# Altium schematic sheet FPGA_MGT.SchDoc: SVPXFMC Carrier 3U
size 420 x 297 mm; CheckedBy: \; Author: G.Kasprowicz; CompanyName: ISE; DrawnBy: T.Przywozki; Organization: WUT ISE; Address1: Warsaw University of Technology; Address2: Nowowiejska 15/19 00-665 Warsaw; Revision: 1.0.; SheetNumber: 9; SheetTotal: 20; Project: SVPXFMC Carrier 3U; ModifiedBy: -; CheckedDate: -; Title2: FPGA MGT; DivGrp: ISE; Designer: G. Kasprowicz
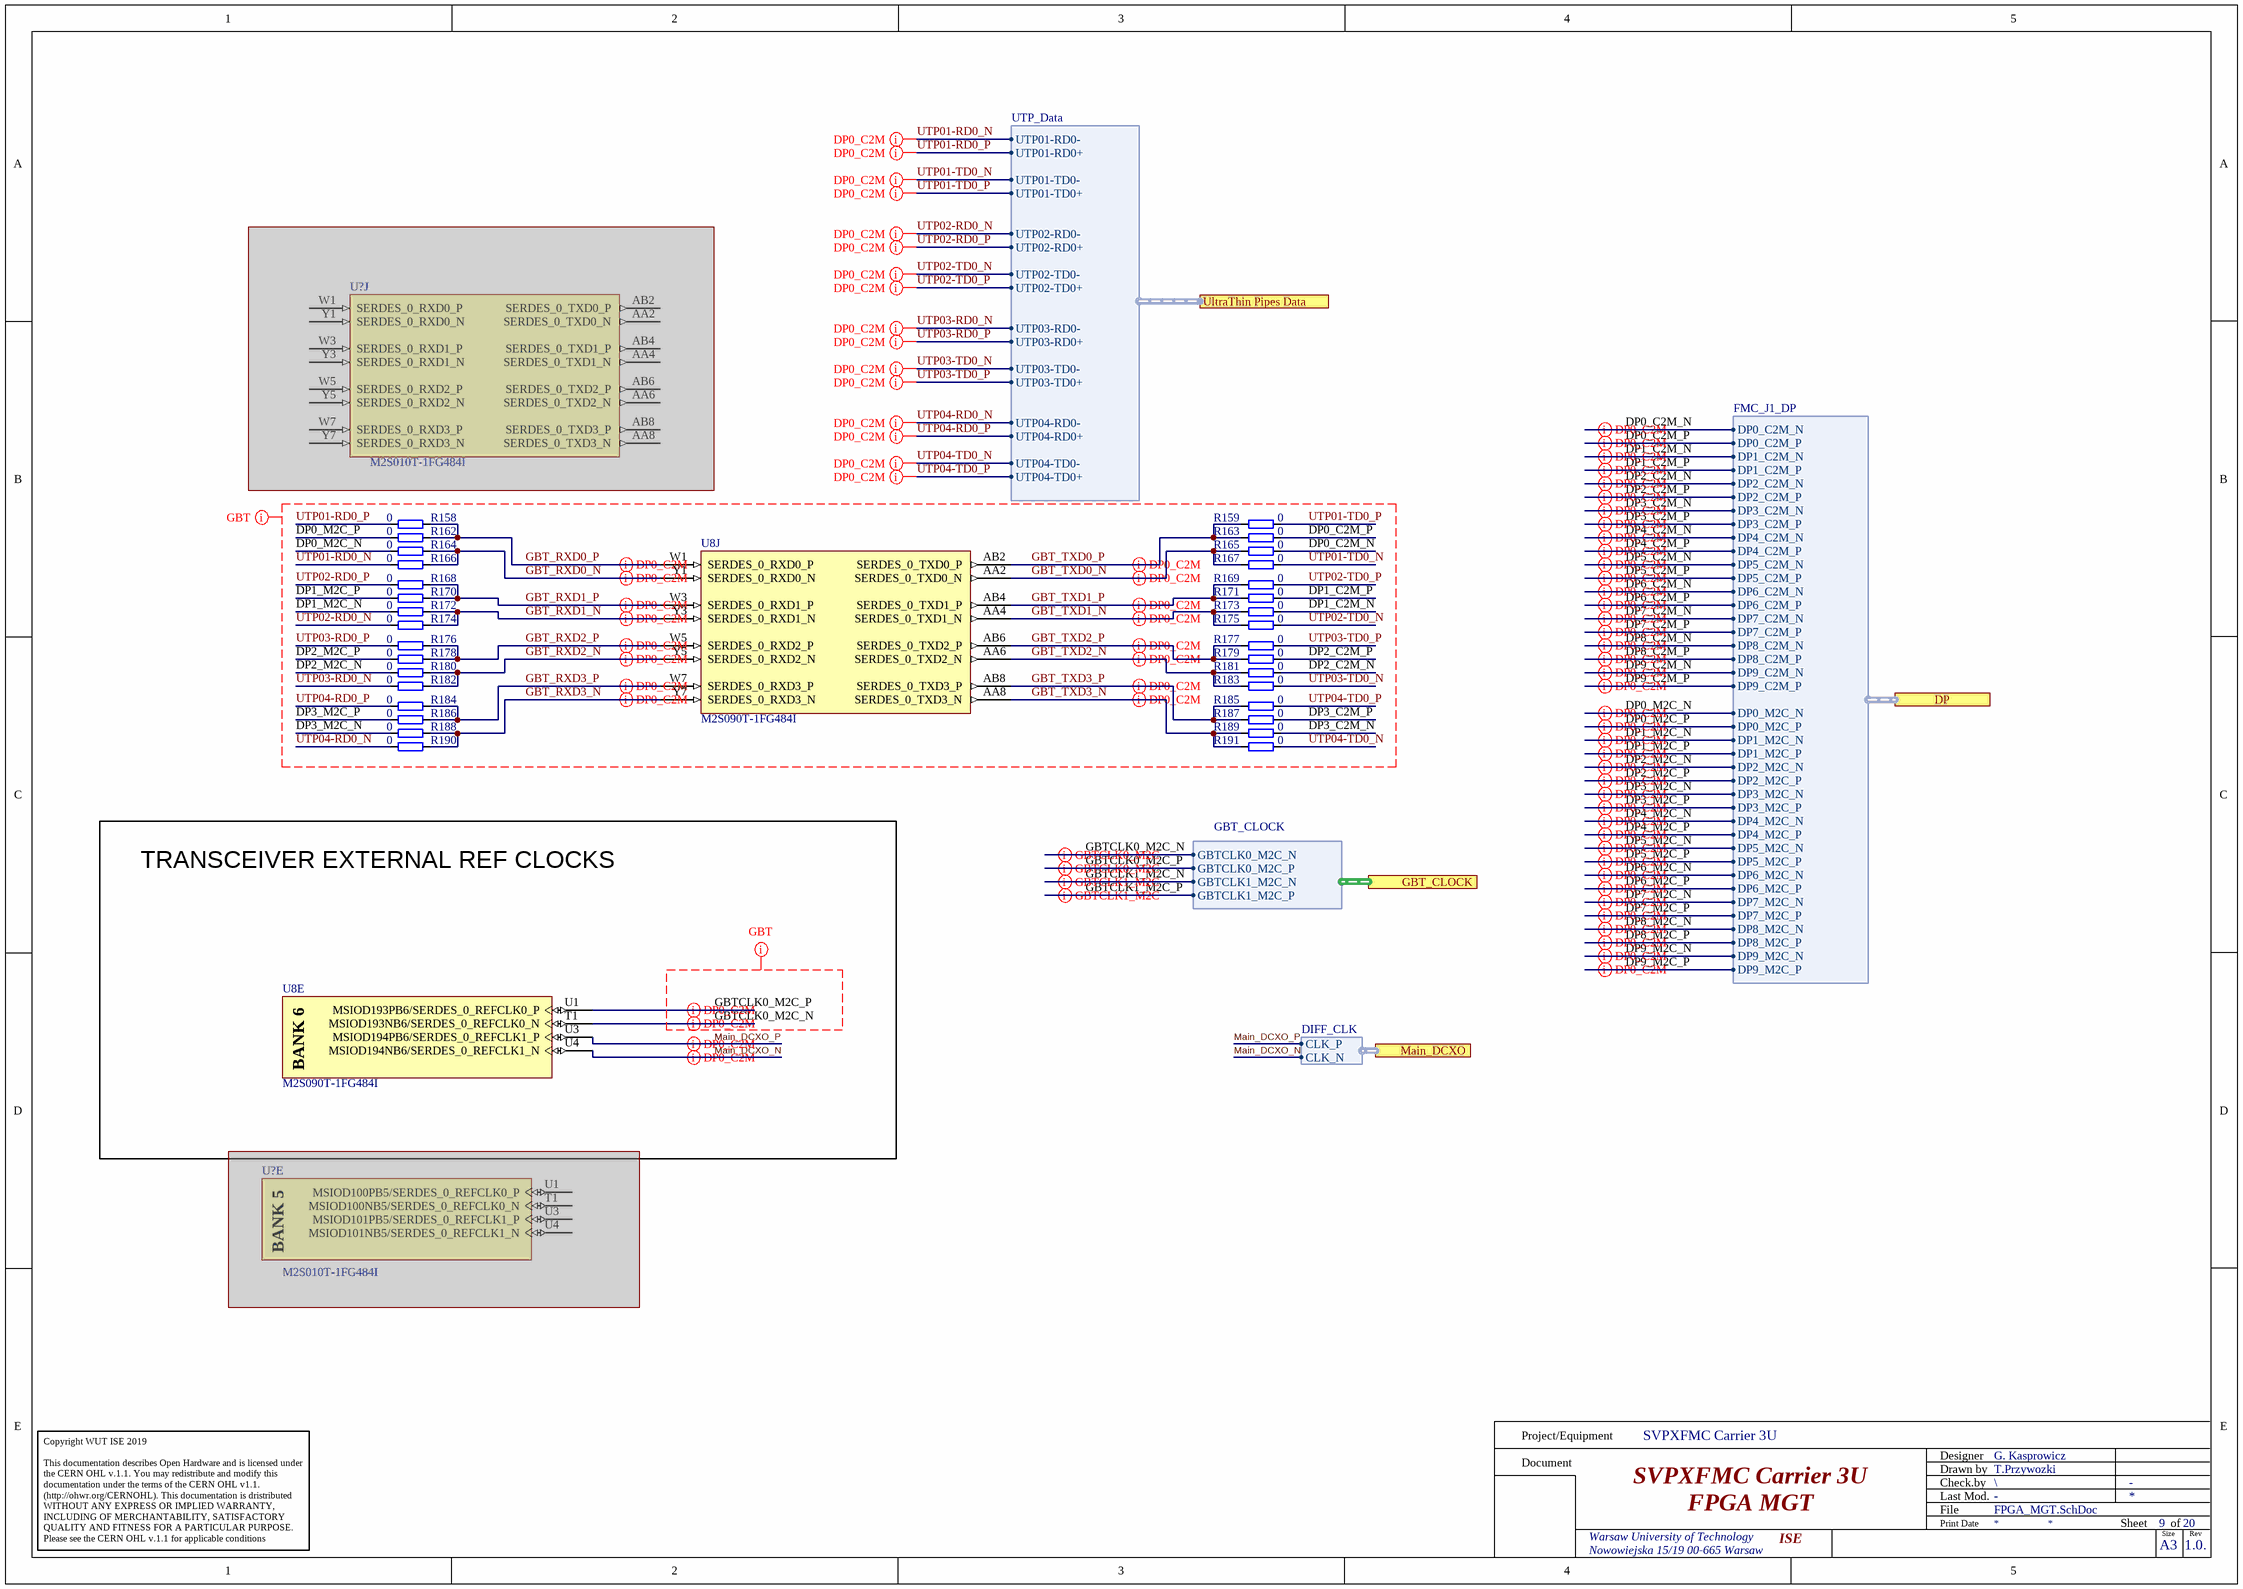
[diagram p0: FPGA_MGT.SchDoc]

## Parts
(Parts that share a designator on the sheet are numbered #1, #2 ... from top to bottom, then left to right.)
R158  0  [RESC0603X28N]
R159  0  [RESC0603X28N]
R162  0  [RESC0603X28N]
R163  0  [RESC0603X28N]
R164  0  [RESC0603X28N]
R165  0  [RESC0603X28N]
R166  0  [RESC0603X28N]
R167  0  [RESC0603X28N]
R168  0  [RESC0603X28N]
R169  0  [RESC0603X28N]
R170  0  [RESC0603X28N]
R171  0  [RESC0603X28N]
R172  0  [RESC0603X28N]
R173  0  [RESC0603X28N]
R174  0  [RESC0603X28N]
R175  0  [RESC0603X28N]
R176  0  [RESC0603X28N]
R177  0  [RESC0603X28N]
R178  0  [RESC0603X28N]
R179  0  [RESC0603X28N]
R180  0  [RESC0603X28N]
R181  0  [RESC0603X28N]
R182  0  [RESC0603X28N]
R183  0  [RESC0603X28N]
R184  0  [RESC0603X28N]
R185  0  [RESC0603X28N]
R186  0  [RESC0603X28N]
R187  0  [RESC0603X28N]
R188  0  [RESC0603X28N]
R189  0  [RESC0603X28N]
R190  0  [RESC0603X28N]
R191  0  [RESC0603X28N]
U8  M2S090T-1FG484I  [MCSM-FG-484_V]  (parts E,J of 15)
U?#1  M2S010T-1FG484I  [MCSM-FG-484_V]  (part J of 16)  (masked out: inside a compile mask, not in the netlist)
U?#2  M2S010T-1FG484I  [MCSM-FG-484_V]  (part E of 16)  (masked out: inside a compile mask, not in the netlist)

## Blocks framed on the sheet
TRANSCEIVER EXTERNAL REF CLOCKS: U8

## Ports
DP (harness FMC_J1_DP), GBT_CLOCK (harness GBT_CLOCK), Main_DCXO (harness DIFF_CLK), UltraThin Pipes Data (harness UTP_Data)

## Harnesses
FMC_J1_DP: DP1_C2M_N, DP1_C2M_P, DP1_M2C_N, DP1_M2C_P, DP2_C2M_N, DP2_C2M_P, DP2_M2C_N, DP2_M2C_P, DP3_C2M_N, DP3_C2M_P, DP3_M2C_N, DP3_M2C_P, DP0_C2M_N, DP0_C2M_P, DP0_M2C_N, DP0_M2C_P, DP4_C2M_N, DP4_C2M_P, DP5_C2M_N, DP5_C2M_P, DP6_C2M_N, DP6_C2M_P, DP7_C2M_N, DP7_C2M_P, DP8_C2M_N, DP8_C2M_P, DP9_C2M_N, DP9_C2M_P, DP4_M2C_N, DP4_M2C_P, DP5_M2C_N, DP5_M2C_P, DP6_M2C_N, DP6_M2C_P, DP7_M2C_N, DP7_M2C_P, DP8_M2C_N, DP8_M2C_P, DP9_M2C_N, DP9_M2C_P
GBT_CLOCK: GBTCLK0_M2C_N, GBTCLK0_M2C_P, GBTCLK1_M2C_N, GBTCLK1_M2C_P
DIFF_CLK: CLK_N, CLK_P
UTP_Data: UTP01-RD0-, UTP01-RD0+, UTP01-TD0-, UTP01-TD0+, UTP02-RD0-, UTP02-RD0+, UTP02-TD0-, UTP02-TD0+, UTP03-RD0-, UTP03-RD0+, UTP03-TD0-, UTP03-TD0+, UTP04-RD0-, UTP04-RD0+, UTP04-TD0-, UTP04-TD0+

## Nets
DP0_C2M_N: R165.2 ; port DP.DP0_C2M_N
DP0_C2M_P: R163.2 ; port DP.DP0_C2M_P
DP0_M2C_N: R164.2 ; port DP.DP0_M2C_N
DP0_M2C_P: R162.2 ; port DP.DP0_M2C_P
DP1_C2M_N: R173.2 ; port DP.DP1_C2M_N
DP1_C2M_P: R171.2 ; port DP.DP1_C2M_P
DP1_M2C_N: R172.2 ; port DP.DP1_M2C_N
DP1_M2C_P: R170.2 ; port DP.DP1_M2C_P
DP2_C2M_N: R181.2 ; port DP.DP2_C2M_N
DP2_C2M_P: R179.2 ; port DP.DP2_C2M_P
DP2_M2C_N: R180.2 ; port DP.DP2_M2C_N
DP2_M2C_P: R178.2 ; port DP.DP2_M2C_P
DP3_C2M_N: R189.2 ; port DP.DP3_C2M_N
DP3_C2M_P: R187.2 ; port DP.DP3_C2M_P
DP3_M2C_N: R188.2 ; port DP.DP3_M2C_N
DP3_M2C_P: R186.2 ; port DP.DP3_M2C_P
DP4_C2M_N: port DP.DP4_C2M_N
DP4_C2M_P: port DP.DP4_C2M_P
DP4_M2C_N: port DP.DP4_M2C_N
DP4_M2C_P: port DP.DP4_M2C_P
DP5_C2M_N: port DP.DP5_C2M_N
DP5_C2M_P: port DP.DP5_C2M_P
DP5_M2C_N: port DP.DP5_M2C_N
DP5_M2C_P: port DP.DP5_M2C_P
DP6_C2M_N: port DP.DP6_C2M_N
DP6_C2M_P: port DP.DP6_C2M_P
DP6_M2C_N: port DP.DP6_M2C_N
DP6_M2C_P: port DP.DP6_M2C_P
DP7_C2M_N: port DP.DP7_C2M_N
DP7_C2M_P: port DP.DP7_C2M_P
DP7_M2C_N: port DP.DP7_M2C_N
DP7_M2C_P: port DP.DP7_M2C_P
DP8_C2M_N: port DP.DP8_C2M_N
DP8_C2M_P: port DP.DP8_C2M_P
DP8_M2C_N: port DP.DP8_M2C_N
DP8_M2C_P: port DP.DP8_M2C_P
DP9_C2M_N: port DP.DP9_C2M_N
DP9_C2M_P: port DP.DP9_C2M_P
DP9_M2C_N: port DP.DP9_M2C_N
DP9_M2C_P: port DP.DP9_M2C_P
GBT_RXD0_N: R164.1 R166.1 U8.Y1(SERDES_0_RXD0_N)
GBT_RXD0_P: R158.1 R162.1 U8.W1(SERDES_0_RXD0_P)
GBT_RXD1_N: R172.1 R174.1 U8.Y3(SERDES_0_RXD1_N)
GBT_RXD1_P: R168.1 R170.1 U8.W3(SERDES_0_RXD1_P)
GBT_RXD2_N: R180.1 R182.1 U8.Y5(SERDES_0_RXD2_N)
GBT_RXD2_P: R176.1 R178.1 U8.W5(SERDES_0_RXD2_P)
GBT_RXD3_N: R188.1 R190.1 U8.Y7(SERDES_0_RXD3_N)
GBT_RXD3_P: R184.1 R186.1 U8.W7(SERDES_0_RXD3_P)
GBT_TXD0_N: R165.1 R167.1 U8.AA2(SERDES_0_TXD0_N)
GBT_TXD0_P: R159.1 R163.1 U8.AB2(SERDES_0_TXD0_P)
GBT_TXD1_N: R173.1 R175.1 U8.AA4(SERDES_0_TXD1_N)
GBT_TXD1_P: R169.1 R171.1 U8.AB4(SERDES_0_TXD1_P)
GBT_TXD2_N: R181.1 R183.1 U8.AA6(SERDES_0_TXD2_N)
GBT_TXD2_P: R177.1 R179.1 U8.AB6(SERDES_0_TXD2_P)
GBT_TXD3_N: R189.1 R191.1 U8.AA8(SERDES_0_TXD3_N)
GBT_TXD3_P: R185.1 R187.1 U8.AB8(SERDES_0_TXD3_P)
GBTCLK0_M2C_N: U8.T1(MSIOD193NB6/SERDES_0_REFCLK0_N) ; port GBT_CLOCK.GBTCLK0_M2C_N
GBTCLK0_M2C_P: U8.U1(MSIOD193PB6/SERDES_0_REFCLK0_P) ; port GBT_CLOCK.GBTCLK0_M2C_P
GBTCLK1_M2C_N: port GBT_CLOCK.GBTCLK1_M2C_N
GBTCLK1_M2C_P: port GBT_CLOCK.GBTCLK1_M2C_P
Main_DCXO_N: U8.U4(MSIOD194NB6/SERDES_0_REFCLK1_N) ; port Main_DCXO.CLK_N
Main_DCXO_P: U8.U3(MSIOD194PB6/SERDES_0_REFCLK1_P) ; port Main_DCXO.CLK_P
UTP01-RD0_N: R166.2 ; port UltraThin Pipes Data.UTP01-RD0-
UTP01-RD0_P: R158.2 ; port UltraThin Pipes Data.UTP01-RD0+
UTP01-TD0_N: R167.2 ; port UltraThin Pipes Data.UTP01-TD0-
UTP01-TD0_P: R159.2 ; port UltraThin Pipes Data.UTP01-TD0+
UTP02-RD0_N: R174.2 ; port UltraThin Pipes Data.UTP02-RD0-
UTP02-RD0_P: R168.2 ; port UltraThin Pipes Data.UTP02-RD0+
UTP02-TD0_N: R175.2 ; port UltraThin Pipes Data.UTP02-TD0-
UTP02-TD0_P: R169.2 ; port UltraThin Pipes Data.UTP02-TD0+
UTP03-RD0_N: R182.2 ; port UltraThin Pipes Data.UTP03-RD0-
UTP03-RD0_P: R176.2 ; port UltraThin Pipes Data.UTP03-RD0+
UTP03-TD0_N: R183.2 ; port UltraThin Pipes Data.UTP03-TD0-
UTP03-TD0_P: R177.2 ; port UltraThin Pipes Data.UTP03-TD0+
UTP04-RD0_N: R190.2 ; port UltraThin Pipes Data.UTP04-RD0-
UTP04-RD0_P: R184.2 ; port UltraThin Pipes Data.UTP04-RD0+
UTP04-TD0_N: R191.2 ; port UltraThin Pipes Data.UTP04-TD0-
UTP04-TD0_P: R185.2 ; port UltraThin Pipes Data.UTP04-TD0+

## Layout directives
differential pair: GBTCLK0_M2C_N, GBTCLK0_M2C_P, GBTCLK1_M2C_N, GBTCLK1_M2C_P, Main_DCXO_N, Main_DCXO_P
differential pair; differential pair class GBT: DP0_C2M_N, DP0_C2M_P, DP0_M2C_N, DP0_M2C_P, DP1_C2M_N, DP1_C2M_P, DP1_M2C_N, DP1_M2C_P, DP2_C2M_N, DP2_C2M_P, DP2_M2C_N, DP2_M2C_P, DP3_C2M_N, DP3_C2M_P, DP3_M2C_N, DP3_M2C_P, DP4_C2M_N, DP4_C2M_P, DP4_M2C_N, DP4_M2C_P, DP5_C2M_N, DP5_C2M_P, DP5_M2C_N, DP5_M2C_P, DP6_C2M_N, DP6_C2M_P, DP6_M2C_N, DP6_M2C_P, DP7_C2M_N, DP7_C2M_P, DP7_M2C_N, DP7_M2C_P, DP8_C2M_N, DP8_C2M_P, DP8_M2C_N, DP8_M2C_P, DP9_C2M_N, DP9_C2M_P, DP9_M2C_N, DP9_M2C_P, GBT_RXD0_N, GBT_RXD0_P, GBT_RXD1_N, GBT_RXD1_P, GBT_RXD2_N, GBT_RXD2_P, GBT_RXD3_N, GBT_RXD3_P, GBT_TXD0_N, GBT_TXD0_P, GBT_TXD1_N, GBT_TXD1_P, GBT_TXD2_N, GBT_TXD2_P, GBT_TXD3_N, GBT_TXD3_P, GBTCLK0_M2C_N, GBTCLK0_M2C_P, UTP01-RD0_N, UTP01-RD0_P, UTP01-TD0_N, UTP01-TD0_P, UTP02-RD0_N, UTP02-RD0_P, UTP02-TD0_N, UTP02-TD0_P, UTP03-RD0_N, UTP03-RD0_P, UTP03-TD0_N, UTP03-TD0_P, UTP04-RD0_N, UTP04-RD0_P, UTP04-TD0_N, UTP04-TD0_P
net class GBT: DP0_C2M_N, DP0_C2M_P, DP0_M2C_N, DP0_M2C_P, DP1_C2M_N, DP1_C2M_P, DP1_M2C_N, DP1_M2C_P, DP2_C2M_N, DP2_C2M_P, DP2_M2C_N, DP2_M2C_P, DP3_C2M_N, DP3_C2M_P, DP3_M2C_N, DP3_M2C_P, GBT_RXD0_N, GBT_RXD0_P, GBT_RXD1_N, GBT_RXD1_P, GBT_RXD2_N, GBT_RXD2_P, GBT_RXD3_N, GBT_RXD3_P, GBT_TXD0_N, GBT_TXD0_P, GBT_TXD1_N, GBT_TXD1_P, GBT_TXD2_N, GBT_TXD2_P, GBT_TXD3_N, GBT_TXD3_P, GBTCLK0_M2C_N, GBTCLK0_M2C_P, UTP01-RD0_N, UTP01-RD0_P, UTP01-TD0_N, UTP01-TD0_P, UTP02-RD0_N, UTP02-RD0_P, UTP02-TD0_N, UTP02-TD0_P, UTP03-RD0_N, UTP03-RD0_P, UTP03-TD0_N, UTP03-TD0_P, UTP04-RD0_N, UTP04-RD0_P, UTP04-TD0_N, UTP04-TD0_P

## Notes on the sheet
- Project/Equipment
- Document
- Designer
- Drawn by
- Check.by
- File
- Last Mod.
- Print Date
- Sheet
- Size
- A3
- of
- Rev
- Copyright WUT ISE 2019
  This documentation describes Open Hardware and is licensed under the CERN OHL v.1.1. You may redistribute and modify this documentation under the terms of the CERN OHL v1.1.
  (http://ohwr.org/CERNOHL). This documentation is dristributed WITHOUT ANY EXPRESS OR IMPLIED WARRANTY, INCLUDING OF MERCHANTABILITY, SATISFACTORY QUALITY AND FITNESS FOR A PARTICULAR PURPOSE. Please see the CERN OHL v.1.1 for applicable conditions
- (in symbol CMP-0959-00045-1, part E) BANK 6
- (in symbol CMP-0959-00069-1, part E) BANK 5

## Library data of the parts
R158 R159 R162-R191 = R0201_0R_JUMPER: Resistor; Part Description: 1A (0.05R Max DC Resistance) Zero Ohm Jumper; Manufacturer: GENERIC; Manufacturer1 Part Number: CRCW02010000Z0ED; PressFit: No; Part Number: R0201_0R_JUMPER; Component Kind: Standard; Component Type: Standard; Pin Count: 2; Value: 0; Status: Not Recommended; Manufacturer Part Number: R0201_0R_JUMPER; Case: 0201; Mounted: Yes; Sense: No; Socket: No; SMD: Yes; Manufacturer1 Example: VISHAY; Manufacturer1 ComponentHeight: 0.27mm; HelpURL: \\cern.ch\dfs\Applications\Altium\Datasheets\R0201_VISHAY_CRCW e3.pdf; Author: CERN DEM JLC; CreateDate: 19.11.2014; LatestRevisionDate: 08.01.2015
U8 = CMP-0959-00045-1: SmartFusion2 SoC FPGA, ARM Cortex-M3, 90 K LUTs, 267 User I/O, Transceiver Available, Design Security, Speed Grade 1, -40 to 100 degC, 484-Ball BGA; Manufacturer: Microsemi; Total User I/O: 267; PLLs and CCCs: 6; LSRAM 18K Blocks: 109; eNVM (K Bytes): 512; DDR Controllers (Count x Width): 1x18; Math Blocks (18x18): 84; Maximum Logic Elements: 86,316; eSRAM (K Bytes): 64; MSIOD (2.5V): 40; SERDES Lanes: 4; MSIO (3.3V): 157; Total RAM (K bits): 2074; DDRIO (2.5V): 70; uSRAM1K Blocks: 112; eSRAM (K Bytes) Non SECDED: 80; ComponentLink3URL: http://www.microsemi.com/document-portal/doc_download/131095-package-mechanical-drawings; DatasheetVersion: Rev. 5; ComponentLink3Description: Package Specification; ComponentLink1Description: Manufacturer URL; PackageReference: FG-484; RoHS: FALSE; ComponentLink1URL: http://www.microsemi.com/; Code_JEDEC: MS-034; Mounting Technology: Surface Mount; PackageDescription: 484-Ball Fine Pitch Plastic Ball Grid Array (FBGA), Body 23 x 23 mm, Pitch 1 mm; PackageVersion: Rev. 48, 11/2013; ComponentLink2URL: http://www.microsemi.com/document-portal/doc_download/130717-smartfusion2-datasheet; PartNumber: M2S090T-1FG484I; ComponentLink2Description: Datasheet; PartId: 1
U?#1 U?#2 = CMP-0959-00069-1: SmartFusion2 SoC FPGA, ARM Cortex-M3, 10 K LUTs, 233 User I/O, Transceiver Available, Design Security, Speed Grade 1, -40 to 100 degC, 484-Ball BGA; Manufacturer: Microsemi; MSIO (3.3V): 123; DDRIO (2.5V): 70; eSRAM (K Bytes): 64; uSRAM1K Blocks: 22; SERDES Lanes: 4; DDR Controllers (Count x Width): 1x18; MSIOD (2.5V): 40; Maximum Logic Elements: 12,084; eNVM (K Bytes): 256; PLLs and CCCs: 2; LSRAM 18K Blocks: 21; eSRAM (K Bytes) Non SECDED: 80; Total RAM (K bits): 400; Total User I/O: 233; PackageVersion: Rev. 48, 11/2013; ComponentLink3URL: http://www.microsemi.com/document-portal/doc_download/131095-package-mechanical-drawings; ComponentLink1Description: Manufacturer URL; DatasheetVersion: Rev. 5; RoHS: FALSE; ComponentLink2Description: Datasheet; Code_JEDEC: MS-034; ComponentLink3Description: Package Specification; ComponentLink2URL: http://www.microsemi.com/document-portal/doc_download/130717-smartfusion2-datasheet; PartNumber: M2S010T-1FG484I; ComponentLink1URL: http://www.microsemi.com/; Math Blocks (18x18): 22; Mounting Technology: Surface Mount; PackageDescription: 484-Ball Fine Pitch Plastic Ball Grid Array (FBGA), Body 23 x 23 mm, Pitch 1 mm; PackageReference: FG-484